# Altium schematic sheet 原理图.schdoc
size 309 x 223 mm; Symbol: Sheet-Symbol_A4; Device: Sheet-Symbol_A4; Company: 嘉立创EDA; Version: V1.0; Page Size: A4; @Project Name: STM32温湿度-闹钟-万年历; @Page Count: 1; @Update Date: 2024-05-24; @Create Date: 2024-05-24; @Schematic Name: STM32温湿度-闹钟-万年历; @Page No: 1; @Page Name: STM32温湿度-闹钟-万年历
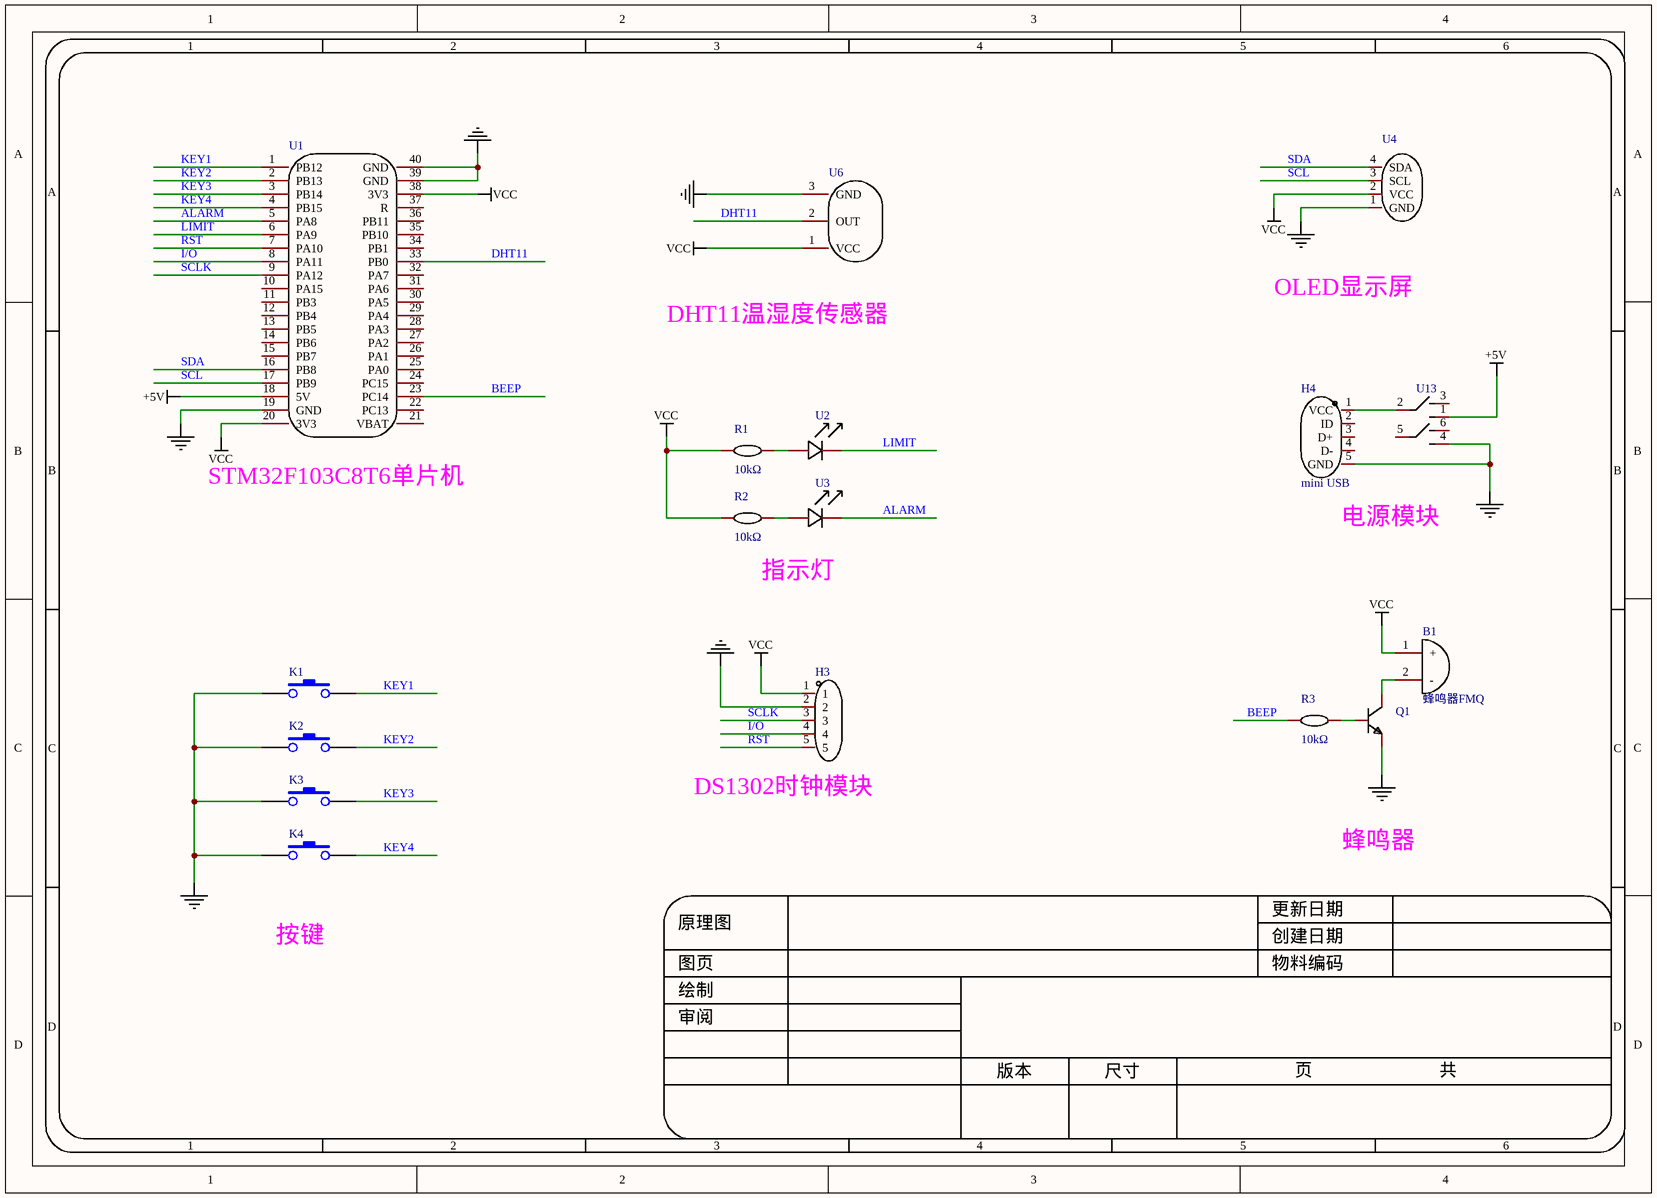
[diagram p0: 原理图.schdoc]

## Parts
(Parts that share a designator on the sheet are numbered #1, #2 ... from top to bottom, then left to right.)
B1  蜂鸣器FMQ  [蜂鸣器]
H3  HDR-M_2.54_1x5P  [HDR-TH_5P-P2.54-V-M]  (value not drawn)
H4  mini USB  [MINI-USB-POWER]
KEY?#1  K1  [SWT3*4]
KEY?#2  K2  [SWT3*4]
KEY?#3  K3  [SWT3*4]
KEY?#4  K4  [SWT3*4]
Q1  S8050_TO_NPN  [S8050_TO_92]  (value not drawn)
R1  10kΩ  [Res_1/4W]
R2  10kΩ  [Res_1/4W]
R3  10kΩ  [Res_1/4W]
U1  STM32F103C8T6小蓝板  [STM32F103C8T6最小系统板(蓝)]  (value not drawn)
U2  LED_5mm  [LED_5mm]  (value not drawn)
U3  LED_5mm  [LED_5mm]  (value not drawn)
U4  OLED四针0.96寸  [OLED4针0.96寸]  (value not drawn)
U6  DHT11温湿度传感器  [DHT11]  (value not drawn)
U13  按键开关7*7  [按键开关7*7]  (value not drawn)

## Nets
+5V: U1.18(5V) U13.1
NetH3_2: H3.2 H4.5(GND) KEY?#1.1 KEY?#2.1 KEY?#3.1 KEY?#4.1 Q1.1(E) U1.19(GND) U1.39(GND) U1.40(GND) U4.1(GND) U6.3(GND) U13.4
VCC: B1.1(+) H3.1 R1.1 R2.1 U1.20(3V3) U1.38(3V3) U4.2(VCC) U6.1(VCC)
ALARM: U1.5(PA8) U3.1(C)
BEEP: R3.1 U1.23(PC14)
DHT11: U1.33(PB0) U6.2(OUT)
I/O: H3.4 U1.8(PA11)
KEY1: KEY?#1.2 U1.1(PB12)
KEY2: KEY?#2.2 U1.2(PB13)
KEY3: KEY?#3.2 U1.3(PB14)
KEY4: KEY?#4.2 U1.4(PB15)
LIMIT: U1.6(PA9) U2.1(C)
RST: H3.5 U1.7(PA10)
SCL: U1.17(PB9) U4.3(SCL)
SCLK: H3.3 U1.9(PA12)
SDA: U1.16(PB8) U4.4(SDA)
NetB1_2: B1.2(-) Q1.3(C)
NetH4_1: H4.1(VCC) U13.2
NetQ1_2: Q1.2(B) R3.2
NetR1_2: R1.2 U2.2(A)
NetR2_2: R2.2 U3.2(A)

Not connected (* = marked no-connect by the designer): H4 2(ID) 3(D+) 4(D-); U1 10(PA15) 11(PB3) 12(PB4) 13(PB5) 14(PB6) 15(PB7) 21(VBAT) 22(PC13) 24(PC15) 25(PA0) 26(PA1) 27(PA2) 28(PA3) 29(PA4) 30(PA5) 31(PA6) 32(PA7) 34(PB1) 35(PB10) 36(PB11) 37(R); U13 3 5 6

## Notes on the sheet
- DHT11温湿度传感器
- OLED显示屏
- (near U1) STM32F103C8T6单片机
- 电源模块
- 指示灯
- (near H3) DS1302时钟模块
- 蜂鸣器
- 按键
- 1
- 2
- 3
- 4
- 5
- 6
- A
- B
- C
- 原理图
- 创建日期
- 更新日期
- 审阅
- 绘制
- 图页
- 物料编码
- D
- 版本
- 尺寸
- 页
- 共

## Library data of the parts
B1 = 蜂鸣器FMQ: Add into BOM: yes; Reuse Block: 蜂鸣器报警电路; Group ID: 1; Channel ID: $1e35; Name: 蜂鸣器FMQ; Symbol: 蜂鸣器FMQ; Device: 蜂鸣器FMQ; Convert to PCB: yes
H3 = HDR-M_2.54_1x5P: Symbol: MTP125-1105S1; Convert to PCB: yes; Device: HDR-M_2.54_1x5P; Add into BOM: yes; Supplier Part: C358687; Supplier Footprint: 插件
H4 = mini USB: Add into BOM: yes; Check: false; Name: mini USB; Symbol: mini USB; Device: mini USB; Convert to PCB: yes
KEY?#1-KEY?#4 = 按键
Q1 = S8050_TO_NPN: Convert to PCB: yes; Reuse Block: 蜂鸣器报警电路; Group ID: 1; Channel ID: $1e93; Symbol: S8050_TO_NPN; Device: S8050_TO_NPN; Add into BOM: yes; Supplier Footprint: TO-92
R1 R2 = Res_AXIAL-1/4W: Symbol: 电阻; Add into BOM: yes; Name: 10kΩ; Device: Res_AXIAL-1/4W; Supplier Footprint: 轴向引线; Convert to PCB: yes; Value: 10kΩ
R3 = Res_AXIAL-1/4W: Symbol: 电阻; Add into BOM: yes; Reuse Block: 蜂鸣器报警电路; Group ID: 1; Channel ID: $1e119; Name: 10kΩ; Device: Res_AXIAL-1/4W; Supplier Footprint: 轴向引线; Convert to PCB: yes; Value: 10kΩ
U2 U3 = LED_5mm: Add into BOM: yes; Symbol: LED_5mm; Device: LED_5mm; Convert to PCB: yes
U4 = OLED四针0.96寸: Add into BOM: yes; Symbol: OLED四针0.96寸; Device: OLED四针0.96寸; Convert to PCB: yes
U6 = DHT11温湿度传感器: Add into BOM: yes; Symbol: DHT11温湿度传感器; Device: DHT11温湿度传感器; Convert to PCB: yes
U13 = 按键开关7*7: Add into BOM: yes; Check: false; Symbol: 按键开关7*7; Device: 按键开关7*7; Convert to PCB: yes
U1 = STM32F103C8T6小蓝板: Symbol: STM32F103C8T6小蓝板; Device: STM32F103C8T6小蓝板